# Altium schematic sheet LCD&Camera&Connectors.SchDoc: LCD & Camera & Connector
size A4; DocumentNumber: MB1165; Revision: C.1; SheetNumber: 6; SheetTotal: 17; Project: STM32469I-EVAL
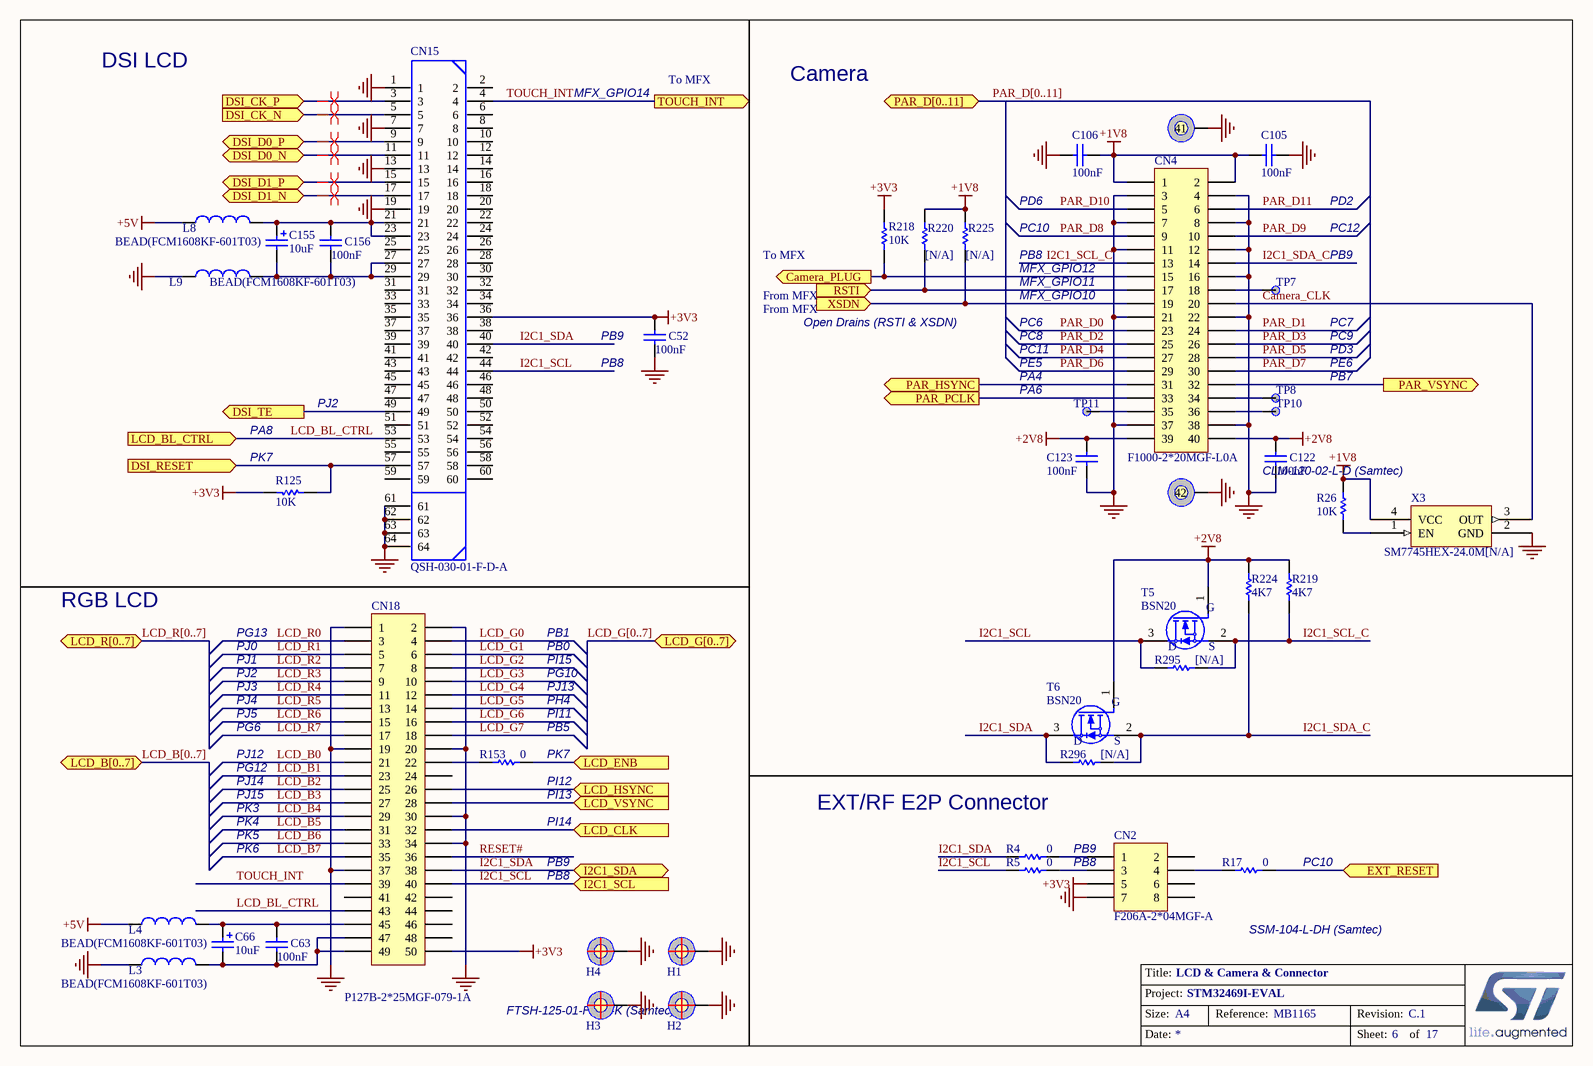
[diagram p0: LCD&Camera&Connectors.SchDoc]

## Parts
C52  100nF  [0603C]
C63  100nF  [0603C]
C66  10uF  [TAN-A]
C105  100nF  [0603C]
C106  100nF  [0603C]
C122  100nF  [0603C]
C123  100nF  [0603C]
C155  10uF  [TAN-A]
C156  100nF  [0603C]
CN2  F206A-2*04MGF-A  [SSM-104-L-DH]
CN4  F1000-2*20MGF-L0A  [CLM-120-02-L-D]
CN15  QSH-030-01-F-D-A  [QSH-030-01-F-D-A]
CN18  P127B-2*25MGF-079-1A  [FTSH-125-01-F-DV]
H1  POSITION HOLE  [HOLE_C9D4R5]  (value not drawn)
H2  POSITION HOLE  [HOLE_C9D4R5]  (value not drawn)
H3  POSITION HOLE  [HOLE_C9D4R5]  (value not drawn)
H4  POSITION HOLE  [HOLE_C9D4R5]  (value not drawn)
L3  BEAD(FCM1608KF-601T03)  [0603L]
L4  BEAD(FCM1608KF-601T03)  [0603L]
L8  BEAD(FCM1608KF-601T03)  [0603L]
L9  BEAD(FCM1608KF-601T03)  [0603L]
R4  0  [0603R]
R5  0  [0603R]
R17  0  [0603R]
R26  10K  [0402R]
R125  10K  [0603R]
R153  0  [0603R]
R218  10K  [0603R]
R219  4K7  [0603R]
R220  [N/A]  [0603R]
R224  4K7  [0603R]
R225  [N/A]  [0603R]
R295  [N/A]  [0603R]
R296  [N/A]  [0603R]
T5  BSN20  [SOT-23]
T6  BSN20  [SOT-23]
TP7  (no value)  [TP]
TP8  (no value)  [TP]
TP10  (no value)  [TP]
TP11  (no value)  [TP]
X3  SM7745HEX-24.0M[N/A]  [OSC_4SM_7X5]

## Ports
Camera_PLUG (out), DSI_CK_N (in), DSI_CK_P (in), DSI_D0_N (bidir), DSI_D0_P (bidir), DSI_D1_N (bidir), DSI_D1_P (bidir), DSI_RESET (in), DSI_TE (out), EXT_RESET (in), I2C1_SCL (in), I2C1_SDA (bidir), LCD_B[0..7] (bidir), LCD_BL_CTRL (in), LCD_CLK (in), LCD_ENB (in), LCD_G[0..7] (bidir), LCD_HSYNC (in), LCD_R[0..7] (bidir), LCD_VSYNC (in), PAR_D[0..11] (bidir), PAR_HSYNC (out), PAR_PCLK (out), PAR_VSYNC (out), RSTI (in), TOUCH_INT (out), XSDN (in)

## Nets
+1V8: C105.1 C106.2 CN4.1 CN4.2 R26.2 R220.2 R225.2 X3.4(VCC)
+2V8: C122.1 C123.1 CN4.39 CN4.40 R219.2 R224.2 T5.1(G) T6.1(G)
+3V3: C52.1 CN2.5 CN15.36 CN18.50 R125.2 R218.1
+5V: L4.1 L8.1
GND: C52.2 C105.2 C106.1 C122.2 C123.2 CN2.7 CN4.3 CN4.4 CN4.7 CN4.8 CN4.11 CN4.12 CN4.16 CN4.21 CN4.22 CN4.37 CN4.38 CN4.41 CN4.42 CN15.1 CN15.7 CN15.13 CN15.19 CN15.61 CN15.62 CN15.63 CN15.64 CN18.1 CN18.2 CN18.19 CN18.20 CN18.30 CN18.34 CN18.37 H1.1 H2.1 H3.1 H4.1 L3.1 L9.1 X3.2(GND)
Camera_CLK: CN4.20 X3.3(OUT)
Camera_PLUG: CN4.15 R218.2 ; port Camera_PLUG
DSI_CK_N: CN15.5 ; port DSI_CK_N
DSI_CK_P: CN15.3 ; port DSI_CK_P
DSI_D0_N: CN15.11 ; port DSI_D0_N
DSI_D0_P: CN15.9 ; port DSI_D0_P
DSI_D1_N: CN15.17 ; port DSI_D1_N
DSI_D1_P: CN15.15 ; port DSI_D1_P
DSI_RESET: CN15.57 R125.1 ; port DSI_RESET
DSI_TE: CN15.49 ; port DSI_TE
EXT_RESET: R17.2 ; port EXT_RESET
I2C1_SCL: CN15.44 CN18.40 R5.1 R295.1 T5.3(D) ; port I2C1_SCL
I2C1_SCL_C: CN4.13 R219.1 R295.2 T5.2(S)
I2C1_SDA: CN15.40 CN18.38 R4.1 R296.1 T6.3(D) ; port I2C1_SDA
I2C1_SDA_C: CN4.14 R224.1 R296.2 T6.2(S)
LCD_B0: CN18.21
LCD_B1: CN18.23
LCD_B2: CN18.25
LCD_B3: CN18.27
LCD_B4: CN18.29
LCD_B5: CN18.31
LCD_B6: CN18.33
LCD_B7: CN18.35
LCD_BL_CTRL: CN15.53 CN18.43 ; port LCD_BL_CTRL
LCD_CLK: CN18.32 ; port LCD_CLK
LCD_ENB: R153.2 ; port LCD_ENB
LCD_G0: CN18.4
LCD_G1: CN18.6
LCD_G2: CN18.8
LCD_G3: CN18.10
LCD_G4: CN18.12
LCD_G5: CN18.14
LCD_G6: CN18.16
LCD_G7: CN18.18
LCD_HSYNC: CN18.26 ; port LCD_HSYNC
LCD_R0: CN18.3
LCD_R1: CN18.5
LCD_R2: CN18.7
LCD_R3: CN18.9
LCD_R4: CN18.11
LCD_R5: CN18.13
LCD_R6: CN18.15
LCD_R7: CN18.17
LCD_VSYNC: CN18.28 ; port LCD_VSYNC
PAR_D0: CN4.23
PAR_D1: CN4.24
PAR_D2: CN4.25
PAR_D3: CN4.26
PAR_D4: CN4.27
PAR_D5: CN4.28
PAR_D6: CN4.29
PAR_D7: CN4.30
PAR_D8: CN4.9
PAR_D9: CN4.10
PAR_D10: CN4.5
PAR_D11: CN4.6
PAR_HSYNC: CN4.31 ; port PAR_HSYNC
PAR_PCLK: CN4.33 ; port PAR_PCLK
PAR_VSYNC: CN4.32 ; port PAR_VSYNC
RESET#: CN18.36
RSTI: CN4.17 R220.1 ; port RSTI
TOUCH_INT: CN15.4 CN18.39 ; port TOUCH_INT
XSDN: CN4.19 R225.1 ; port XSDN
NetC63_1: C63.1 C66.1 CN18.45 L4.2
NetC63_2: C63.2 C66.2 CN18.47 CN18.49 L3.2
NetC155_1: C155.1 C156.1 CN15.21 CN15.23 L8.2
NetC155_2: C155.2 C156.2 CN15.27 CN15.29 L9.2
NetCN2_1: CN2.1 R4.2
NetCN2_3: CN2.3 R5.2
NetCN2_4: CN2.4 R17.1
NetCN4_18: CN4.18 TP7.1
NetCN4_34: CN4.34 TP8.1
NetCN4_35: CN4.35 TP11.1
NetCN4_36: CN4.36 TP10.1
NetCN18_22: CN18.22 R153.1
NetR26_1: R26.1 X3.1(EN)

Not connected (* = marked no-connect by the designer): CN2 2 6 8; CN15 2 6 8 10 12 14 16 18 20 22 24 25 26 28 30 31 32 33 34 35 37 38 39 41 42 43 45 46 47 48 50 51 52 54 55 56 58 59 60; CN18 24 41 42 44 46 48

## Buses and harness runs
bus LCD_B[0..7] = port LCD_B[0..7]
bus LCD_G[0..7] = port LCD_G[0..7]
bus LCD_R[0..7] = port LCD_R[0..7]
bus PAR_D[0..11] = port PAR_D[0..11]

## Layout directives
differential pair: DSI_CK_N, DSI_CK_P, DSI_D0_N, DSI_D0_P, DSI_D1_N, DSI_D1_P

## Notes on the sheet
- DSI LCD
- MFX_GPIO14
- To MFX
- Camera
- PC10
- PB8
- PD6
- PB9
- PD2
- PC12
- From MFX
- Open Drains (RSTI & XSDN)
- PC6
- MFX_GPIO12
- MFX_GPIO10
- MFX_GPIO11
- PC7
- (near C52) PB9
- (near C52) PB8
- PC11
- PE5
- PA4
- PA6
- PC8
- PE6
- PC9
- PB7
- PD3
- PA8
- (near R125) PK7
- PJ2
- (near CN4) CLM-120-02-L-D (Samtec)
- RGB LCD
- PG13
- PJ0
- PJ1
- PB1
- PB0
- PI15
- PJ3
- PJ4
- PJ5
- PG6
- PG10
- PJ13
- PH4
- (near R153) PI11
- (near R153) PB5
- PJ12
- PG12
- PJ14
- PJ15
- (near R153) PK7
- (near R153) PI12
- (near R153) PI13
- PK3
- PK4
- PK5
- PK6
- PI14
- EXT/RF E2P Connector
- (near R17) PC10
- (near CN2) SSM-104-L-DH (Samtec)
- FTSH-125-01-F-DV-K (Samtec)
- Title:
- Project:
- Size:
- Date:
- A4
- Reference:
- Sheet:
- Revision:
- of

## Library data of the parts
C52 C63 C105 C106 C122 C123 C156 = Cap: Capacitor; Value: 10nF; Published: 8-Jun-2000; Revision: July-2002: Re-released for DXP Platform.; Publisher: Altium Limited
C66 C155 = Cap Pol1: Polarized Capacitor (Radial); Published: 8-Jun-2000; Revision: July-2002: Re-released for DXP Platform.; Publisher: Altium Limited; Value: 10uF
CN2 = SSM-104-L-DH: Header, 5-Pin, Dual row; Revision: 17-Jul-2002: Re-released for DXP Platform.; Publisher: Altium Limited
CN4 = CLM-120-02-L-D: Header, 20-Pin, Dual row; Revision: 17-Jul-2002: Re-released for DXP Platform.; Publisher: Altium Limited
CN15 = QSH-030-01-F-D-A: HIGH SPEED SOCKET STRIP, .5mm PITCH, 60 PINS; MANUFACTURER: SAMTEC; PCB DECAL: QSH-030-01-X-D-A; CREATED: 28 JAN 2014 - WENDY XIN
CN18 = Header 25X2: Header, 26-Pin, Dual row; Revision: 17-Jul-2002: Re-released for DXP Platform.; Publisher: Altium Limited
L3 L4 L8 L9 = Inductor: Value: 100uH; Published: 8-Jun-2000; Revision: July-2002: Re-released for DXP Platform.; Publisher: Altium Limited
R4 R5 R17 R26 R125 R153 R218 R295 R296 = Res1: Resistor; Value: 1K; Published: 8-Jun-2000; Revision: July-2002: Re-released for DXP Platform.; Publisher: Altium Limited
R219 R220 R224 R225 = res1: Resistor; Value: 1K; Published: 8-Jun-2000; Revision: July-2002: Re-released for DXP Platform.; Publisher: Altium Limited
T5 T6 = 2N7000
TP7 TP8 TP10 TP11 = TP
X3 = SM7745HEV-50.0M